# EAGLE design CAN_Belegtmelder (EAGLE 9.5.1)
Selectrix Arduino
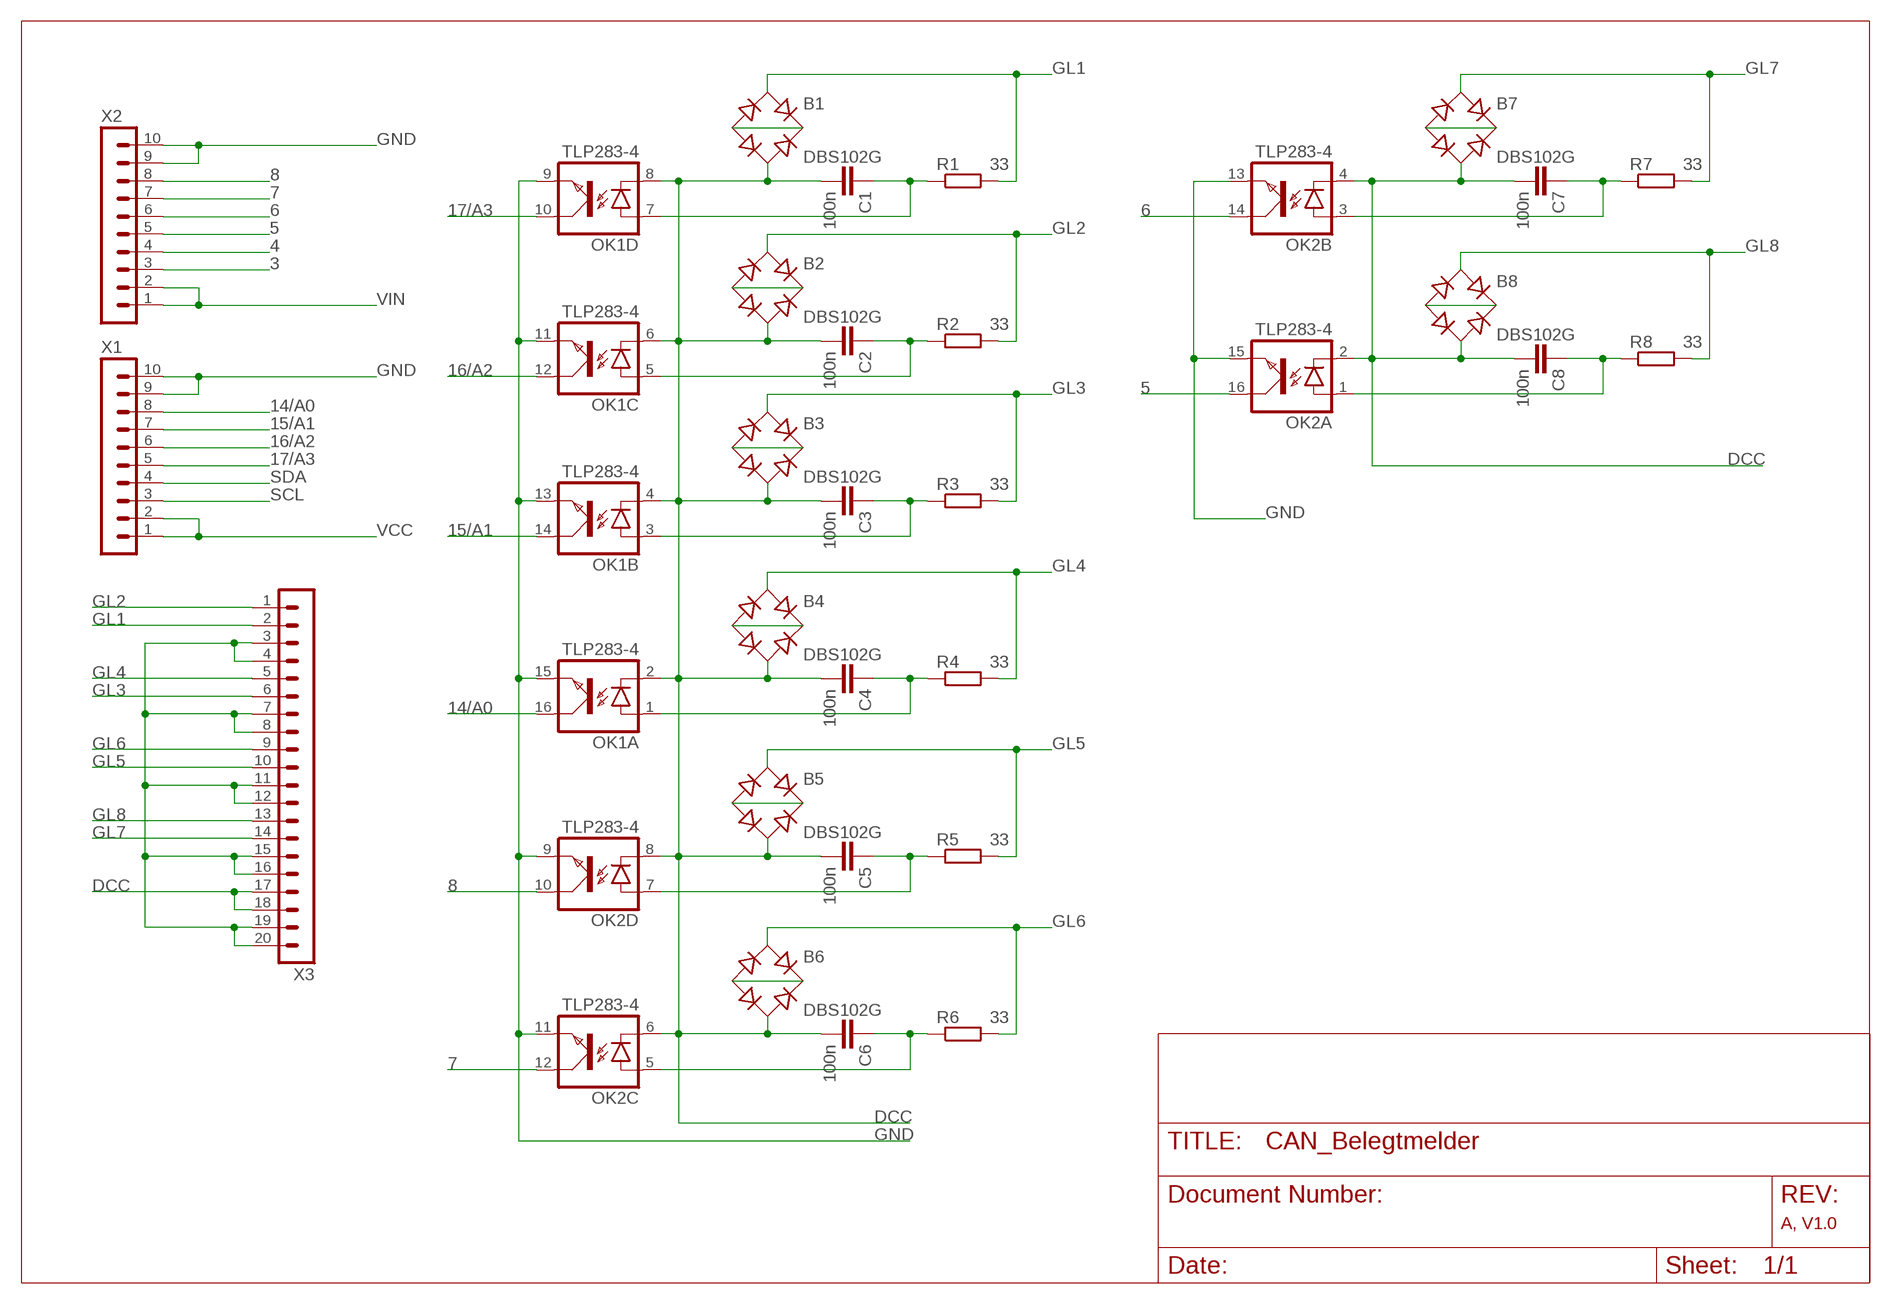
[diagram p0: schematic, sheet 1]

## Parts
B1  DBS102G  [DBS]
B2  DBS102G  [DBS]
B3  DBS102G  [DBS]
B4  DBS102G  [DBS]
B5  DBS102G  [DBS]
B6  DBS102G  [DBS]
B7  DBS102G  [DBS]
B8  DBS102G  [DBS]
C1  100n  C-EUC1206  [C1206]
C2  100n  C-EUC1206  [C1206]
C3  100n  C-EUC1206  [C1206]
C4  100n  C-EUC1206  [C1206]
C5  100n  C-EUC1206  [C1206]
C6  100n  C-EUC1206  [C1206]
C7  100n  C-EUC1206  [C1206]
C8  100n  C-EUC1206  [C1206]
OK1  TLP283-4  [MINI-FLAT-16]
OK2  TLP283-4  [MINI-FLAT-16]
R1  33  R-EU_R1206  [R1206]
R2  33  R-EU_R1206  [R1206]
R3  33  R-EU_R1206  [R1206]
R4  33  R-EU_R1206  [R1206]
R5  33  R-EU_R1206  [R1206]
R6  33  R-EU_R1206  [R1206]
R7  33  R-EU_R1206  [R1206]
R8  33  R-EU_R1206  [R1206]
X1  MA10-1  [MA10-1]
X2  MA10-1  [MA10-1]
X3  MA20-1  [MA20-1]

## Nets
3: X2.3
4: X2.4
5: OK2.16(A:COL) X2.5
6: OK2.14(B:COL) X2.6
7: OK2.12(C:COL) X2.7
8: OK2.10(D:COL) X2.8
14/A0: OK1.16(A:COL) X1.8
15/A1: OK1.14(B:COL) X1.7
16/A2: OK1.12(C:COL) X1.6
17/A3: OK1.10(D:COL) X1.5
DCC: B1.AC2 B2.AC2 B3.AC2 B4.AC2 B5.AC2 B6.AC2 B7.AC2 B8.AC2 C1.2 C2.2 C3.2 C4.2 C5.2 C6.2 C7.2 C8.2 OK1.2(A:C) OK1.4(B:C) OK1.6(C:C) OK1.8(D:C) OK2.2(A:C) OK2.4(B:C) OK2.6(C:C) OK2.8(D:C) X3.17 X3.18
GL1: B1.AC1 R1.2 X3.2
GL2: B2.AC1 R2.2 X3.1
GL3: B3.AC1 R3.2 X3.6
GL4: B4.AC1 R4.2 X3.5
GL5: B5.AC1 R5.2 X3.10
GL6: B6.AC1 R6.2 X3.9
GL7: B7.AC1 R7.2 X3.14
GL8: B8.AC1 R8.2 X3.13
GND: OK1.9(D:EMIT) OK1.11(C:EMIT) OK1.13(B:EMIT) OK1.15(A:EMIT) OK2.9(D:EMIT) OK2.11(C:EMIT) OK2.13(B:EMIT) OK2.15(A:EMIT) X1.9 X1.10 X2.9 X2.10
N$2: C1.1 OK1.7(D:A) R1.1
N$3: B1.+ B1.-
N$4: B2.+ B2.-
N$6: C2.1 OK1.5(C:A) R2.1
N$7: B3.+ B3.-
N$9: C3.1 OK1.3(B:A) R3.1
N$10: B4.+ B4.-
N$12: C4.1 OK1.1(A:A) R4.1
N$13: B5.+ B5.-
N$15: C5.1 OK2.7(D:A) R5.1
N$16: B6.+ B6.-
N$18: C6.1 OK2.5(C:A) R6.1
N$19: B7.+ B7.-
N$21: C7.1 OK2.3(B:A) R7.1
N$22: B8.+ B8.-
N$24: C8.1 OK2.1(A:A) R8.1
N$28: X3.3 X3.4 X3.7 X3.8 X3.11 X3.12 X3.15 X3.16 X3.19 X3.20
SCL: X1.3
SDA: X1.4
VCC: X1.1 X1.2
VIN: X2.1 X2.2

## Notes on the sheet
- A, V1.0

## Library data of the parts
B1-B8 = rectifier:DB?*G: Single Phase 1.0 AMP Glass Passivated Bridge Rectifier Taiwan Semiconductor Co.,Ltd. - TSC Source: http://www.taiwansemi.com/TSCbig5/ezcatfiles/cust/img/img/db101g.pdf http://www.ts.com.tw/db/pictures/modules/PDT/PDT060207001/DBLS201G.pdf
C1-C8 = rcl:C-EU: CAPACITOR, European symbol
OK1 OK2 = optocoupler:TLP283-4: TOSHIBA PHOTOCOUPLER GaAs IRED & PHOTO-TRANSISTOR Source: http://www.semicon.toshiba.co.jp/td/en/Opto/Photocoupler/en_20050928_TLP283_datasheet.pdf; OC_FARNELL: unknown; OC_NEWARK: unknown
R1-R8 = rcl:R-EU_: RESISTOR, European symbol; SPICEPREFIX: R
X1 X2 = con-lstb:MA10-1: PIN HEADER; OC_FARNELL: unknown; OC_NEWARK: unknown
X3 = con-lstb:MA20-1: PIN HEADER; OC_FARNELL: unknown; OC_NEWARK: unknown

## Board
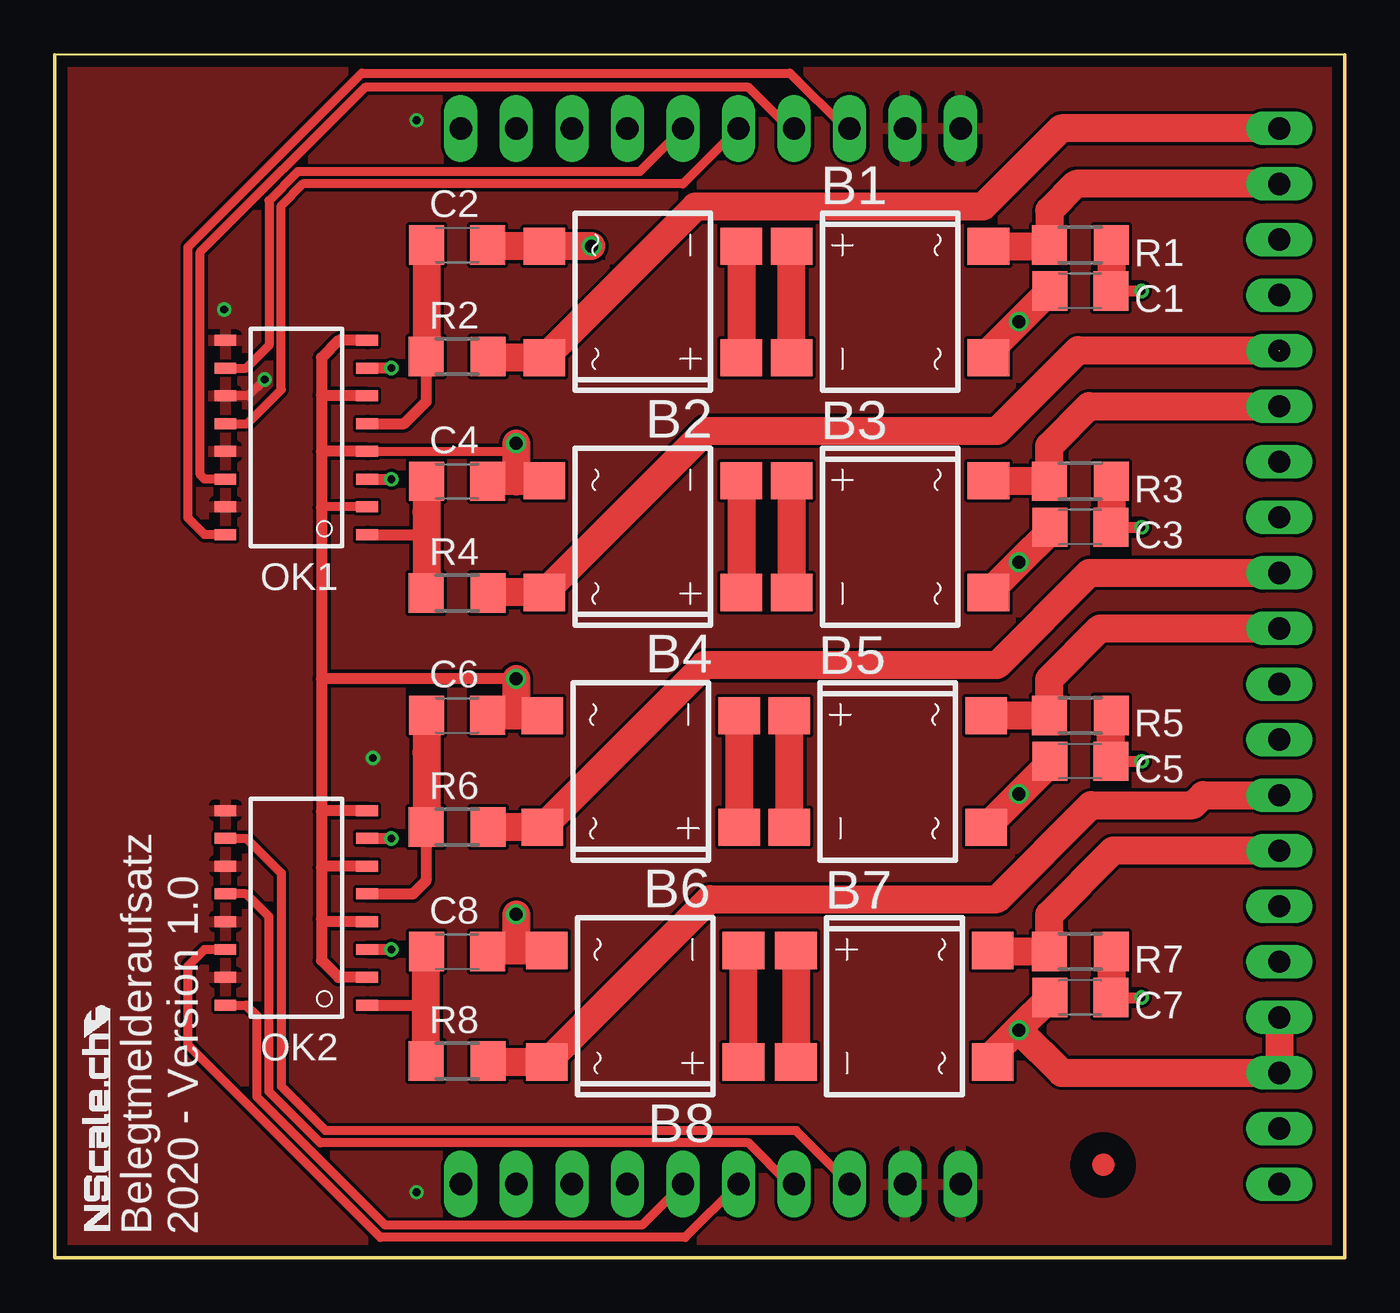
[diagram p1: board, top side]
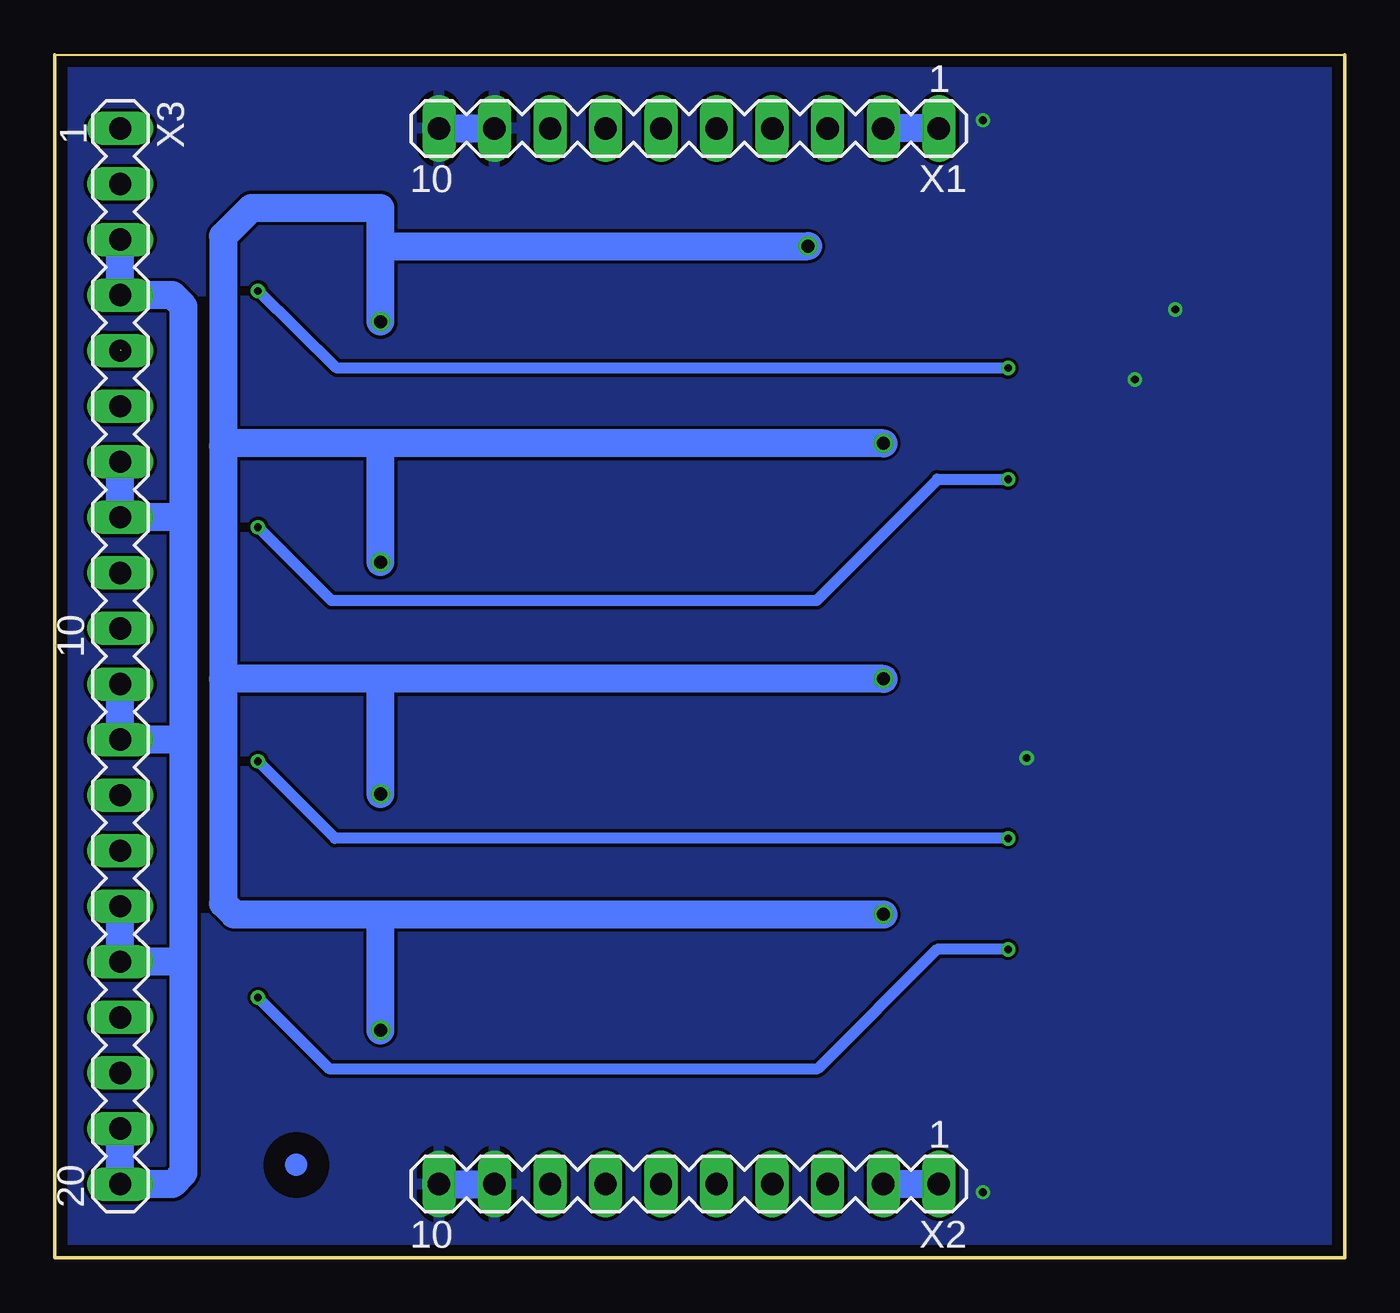
[diagram p2: board, bottom side, seen from below]

Size 59 x 55 mm. Coordinates in mm from the lower left corner, seen from the top.
Outline: 0,0 59,0 59,55 0,55 0,0
Copper layers (1*16): Top 0.035mm / dielectric 1.6mm / Bottom 0.035mm
Design rules "Elecrow_2-layer_PCB_eagle_rule": minimum track width 6mil, minimum drill 12mil, track to track 6mil, track to pad 6mil, pad to pad 6mil, via to via 8mil, smd to smd 0mil, copper to edge 20mil, drill to drill 10mil, minimum pad ring 6mil, minimum via ring 6mil, stop-mask expansion 0mil, vias tented up to drill 100mil, thermal gap 10mil

### Footprints (pad centres in the part's own frame; a part is rotated, then mirrored left to right if it is on the bottom)
DBS = smd 1.7 x 1.9: + -2.55,-4.5; - 2.55,-4.5; AC1 -2.55,4.5; AC2 2.55,4.5
C1206 = smd 1.6 x 1.8: 1 -1.4,0; 2 1.4,0
MINI-FLAT-16 = smd 1 x 0.5: 1 -3.24,4.445; 2 -3.24,3.175; 3 -3.24,1.905; 4 -3.24,0.635; 5 -3.24,-0.635; 6 -3.24,-1.905; 7 -3.24,-3.175; 8 -3.24,-4.445; 9 3.24,-4.445; 10 3.24,-3.175; 11 3.24,-1.905; 12 3.24,-0.635; 13 3.24,0.635; 14 3.24,1.905; 15 3.24,3.175; 16 3.24,4.445
R1206 = smd 1.6 x 1.803: 1 -1.422,0; 2 1.422,0
MA10-1 = drill 1.016 long: 1 -11.43,0; 2 -8.89,0; 3 -6.35,0; 4 -3.81,0; 5 -1.27,0; 6 1.27,0; 7 3.81,0; 8 6.35,0; 9 8.89,0; 10 11.43,0
MA20-1 = drill 1.016 long: 1 -24.13,0; 2 -21.59,0; 3 -19.05,0; 4 -16.51,0; 5 -13.97,0; 6 -11.43,0; 7 -8.89,0; 8 -6.35,0; 9 -3.81,0; 10 -1.27,0; 11 1.27,0; 12 3.81,0; 13 6.35,0; 14 8.89,0; 15 11.43,0; 16 13.97,0; 17 16.51,0; 18 19.05,0; 19 21.59,0; 20 24.13,0

### Placement (x,y rotation side)
B1  38.2,43.7 270 top
B2  26.9,43.7 90 top
B3  38.2,32.97 270 top
B4  26.9,32.97 90 top
B5  38.1,22.23 270 top
B6  26.8,22.23 90 top
B7  38.4,11.5 270 top
B8  27,11.5 90 top
C1  46.9,44.2 180 top
C2  18.4,46.3 0 top
C3  46.9,33.4 180 top
C4  18.4,35.5 0 top
C5  46.9,22.7 180 top
C6  18.4,24.8 0 top
C7  46.9,11.9 180 top
C8  18.4,14 0 top
OK1  11.05,37.5 180 top
OK2  11.05,16 180 top
R1  46.9,46.3 180 top
R2  18.4,41.2 0 top
R3  46.9,35.5 180 top
R4  18.4,30.4 0 top
R5  46.9,24.8 180 top
R6  18.4,19.7 0 top
R7  46.9,14 180 top
R8  18.4,9 0 top
U$2  [CIRCLE-1MM-3R]  47.95,4.25 176.6 top
X1  30,51.63 180 bottom
X2  30,3.37 180 bottom
X3  56,27.5 270 bottom

### Tracks (layer width: path | path; a pad name or v marks a point on that pad's centre or on a via)
5
  Top 0.406: OK2.16 8.77,11.55 9.24,11.08 9.24,7.37 15.12,1.49 26.85,1.49 X2.5
6
  Top 0.406: OK2.14 6.86,14.09 6.1,13.34 6.1,9.72 14.89,0.93 28.83,0.93 X2.6
7
  Top 0.406: OK2.12 8.77,16.64 9.8,15.6 9.8,7.6 12.15,5.25 31.73,5.25 33.61,3.37 X2.7
8
  Top 0.406: OK2.10 8.77,19.18 10.36,17.58 10.36,7.83 12.38,5.81 33.91,5.81 X2.8
14/A0  (via drill 0.35)
  Top 0.406: v36.15,51.63 33.62,54.16 14.05,54.16 6.1,46.21 6.1,33.81 6.86,33.05 OK1.16
  Bottom 0.406: X1.8 v36.15,51.63
15/A1  (via drill 0.35)
  Top 0.406: v33.61,51.63 31.73,53.51 14.19,53.51 6.66,45.98 6.66,35.79 6.86,35.59 OK1.14
  Bottom 0.406: X1.7 v33.61,51.63
16/A2
  Top 0.406: OK1.12 8.8,38.13 10.36,39.69 10.36,48.1 11.35,49.09 28.73,49.09 X1.6
17/A3
  Top 0.406: OK1.10 8.77,40.67 9.8,41.71 9.8,48.33 11.12,49.65 26.75,49.65 X1.5
DCC  (via drill 0.6)
  Top 0.406: OK1.2 12.23,34.33 | OK1.4 20.73,36.87 v21.1,37.23
  Top 0.508: OK2.2 12.98,12.82 12.2,13.6 12.2,15.5 | 12.2,39.45 12.2,41.15 13,41.95 OK1.8 | 12.2,39.45 12.2,36.85 | 12.2,36.85 12.2,34.3 | 12.2,34.3 12.2,26.45 | 12.2,26.45 12.2,20.4 | 12.2,20.4 12.2,17.85 | 12.2,17.85 12.2,15.5 | OK1.6 12.25,39.41 12.2,39.45 | OK1.4 12.21,36.87 12.2,36.85 | 12.23,34.33 12.2,34.3 | OK2.4 12.34,15.36 12.2,15.5 | OK2.6 12.25,17.91 12.2,17.85 | OK2.8 12.25,20.45 12.2,20.4 | v21.1,26.47 12.22,26.47 12.2,26.45
  Top 1.27: B1.AC2 42.7,41.4 v44.1,42.8 C1.2 | B2.AC2 20.8,46.25 | 20.8,46.25 19.85,46.25 C2.2 | B4.AC2 22.38,35.5 21.1,35.5 | 21.1,35.5 C4.2 | 45.5,22.58 B5.AC2 42.6,19.7 v44.1,21.2 45.48,22.58 45.5,22.58 | 45.5,22.58 C5.2 | B6.AC2 21.2,24.78 | 21.2,24.78 19.82,24.78 C6.2 | C7.2 44.05,10.45 | 44.05,10.45 42.9,9.3 B7.AC2 | C8.2 19.85,14.05 21,14.05 | 21,14.05 B8.AC2 | 44.05,10.45 v44.1,10.4 46.05,8.45 X3.18 X3.17 | v24.55,46.25 20.8,46.25 | 20.8,46.25 | v21.1,15.7 21.1,14.15 21,14.05 | v21.1,26.47 21.1,24.88 21.2,24.78 | v21.1,37.23 21.1,35.5 | B3.AC2 42.72,30.42 v44.1,31.8 45.5,33.2 C3.2
  Bottom 1.27: v21.1,37.23 44.07,37.23 | v21.1,26.47 44,26.47 | 44.1,46.25 v24.55,46.25 | v44.1,42.8 44.1,46.25 | 44.1,46.25 44.1,48 50,48 51.3,46.7 51.3,37.1 | v44.1,31.8 44.1,37.2 44.07,37.23 | v44.1,21.2 44.1,26.37 44,26.47 | 44.1,15.7 50.8,15.7 51.3,16.2 51.3,26.45 | 44.1,15.7 v21.1,15.7 | v44.1,10.4 44.1,15.7 | 51.3,37.1 51.3,26.45 | 51.3,37.1 51.17,37.23 44.07,37.23 | 44,26.47 51.28,26.47 51.3,26.45
GL1
  Top 1.27: B1.AC1 45.43,46.25 R1.2 45.48,47.87 46.7,49.09 X3.2
GL2
  Top 1.27: R2.2 19.87,41.15 B2.AC1 29.3,48.05 42.45,48.05 46.03,51.63 X3.1
GL3
  Top 1.27: B3.AC1 45.46,35.52 R3.2 45.48,37.11 47.3,38.93 X3.6
GL4  (1 unrouted)
  Top 1.27: R4.2 19.84,30.42 B4.AC1 29.78,37.8 43.1,37.8 46.8,41.5 55.97,41.5
GL5
  Top 1.27: B5.AC1 45.46,24.78 R5.2 45.48,26.45 47.8,28.77 X3.10
GL6
  Top 1.27: R6.2 19.84,19.68 B6.AC1 29.72,27.1 43.1,27.1 47.31,31.31 X3.9
GL7
  Top 1.27: B7.AC1 42.95,14 R7.2 45.48,15.69 48.4,18.61 X3.14
GL8
  Top 1.27: R8.2 19.87,8.95 B8.AC1 29.95,16.4 43.1,16.4 47.39,20.69 52.06,20.69 52.52,21.15 X3.13
GND  (via drill 0.35)
  Top 0.406: v9.6,40.15 8.86,39.41 OK1.11
  Bottom 1.27: X2.10 X2.9 | X1.10 X1.9
  other vias: 14.55,22.85 16.55,3 16.55,52 7.75,43.35
  pour Top: -10,65 70,65 70,-10 -10,-10
  pour Bottom: -15.7,70 75,70 75,-15 -15.7,-15
N$2  (via drill 0.35)
  Top 0.508: C1.1 v49.7,44.2 | v15.4,40.67 OK1.7
  Top 1.27: R1.1 48.32,44.22 C1.1
  Bottom 0.508: v49.7,44.2 46.1,40.67 v15.4,40.67
N$3
  Top 1.27: B1.- B1.+
N$4
  Top 1.27: B2.- B2.+
N$6
  Top 0.508: OK1.5 15.98,38.13 17,39.15 17,41.22
  Top 1.27: C2.1 17,41.22 R2.1
N$7
  Top 1.27: B3.+ B3.-
N$9  (via drill 0.35)
  Top 0.508: C3.1 v49.7,33.4 | OK1.3 v15.4,35.59
  Top 1.27: R3.1 48.32,33.42 C3.1
  Bottom 0.508: v15.4,35.59 18.65,35.59 18.65,35.55 24.15,30.05 46.35,30.05 v49.7,33.4
N$10
  Top 1.27: B4.- B4.+
N$12
  Top 0.508: OK1.1 16.89,33.05 17,32.95
  Top 1.27: C4.1 17,34.1 17,32.95 17,30.42 R4.1
N$13
  Top 1.27: B5.- B5.+
N$15  (via drill 0.35)
  Top 0.508: C5.1 v49.7,22.7 | OK2.7 v15.4,19.18
  Top 1.27: C5.1 48.3,24.78 R5.1
  Bottom 0.508: v49.7,22.7 46.17,19.18 v15.4,19.18
N$16
  Top 1.27: B6.- B6.+
N$18
  Top 0.508: R6.1 16.98,17.23 16.39,16.64 OK2.5
  Top 1.27: C6.1 17,23.1 17,19.72 R6.1
N$19
  Top 1.27: B7.+ B7.-
N$21  (via drill 0.35)
  Top 0.508: OK2.3 v15.39,14.09 v15.4,14.1 | C7.1 v49.7,11.9
  Top 1.27: R7.1 48.32,11.92 C7.1
  Bottom 0.508: v49.7,11.9 46.45,8.65 24.1,8.65 18.65,14.1 v15.4,14.1
N$22
  Top 1.27: B8.+ B8.-
N$24
  Top 0.508: OK2.1 16.89,11.55 16.91,11.57
  Top 0.61: 16.91,11.57 16.98,11.5
  Top 1.27: R8.1 16.98,11.5 16.98,13.98 C8.1
N$28
  Bottom 1.27: X3.19 X3.20 53.61,3.37 53.1,3.88 53.1,13.53 | X3.15 X3.16 53.1,13.53 | X3.11 X3.12 53.29,23.69 53.1,23.5 | X3.7 X3.8 53.1,33.85 | 53.1,13.53 53.1,23.5 | 53.1,23.5 53.1,33.85 | 53.1,33.85 53.1,43.5 53.61,44.01 X3.4 X3.3
VCC
  Bottom 1.27: X1.1 X1.2
VIN
  Bottom 1.27: X2.1 X2.2

### Text on the board
tPlace: C:/Users/Patrik Laube/Pictures/logo_sw.bmp
tNames: Belegtmelderaufsatz / 2020 - Version 1.0